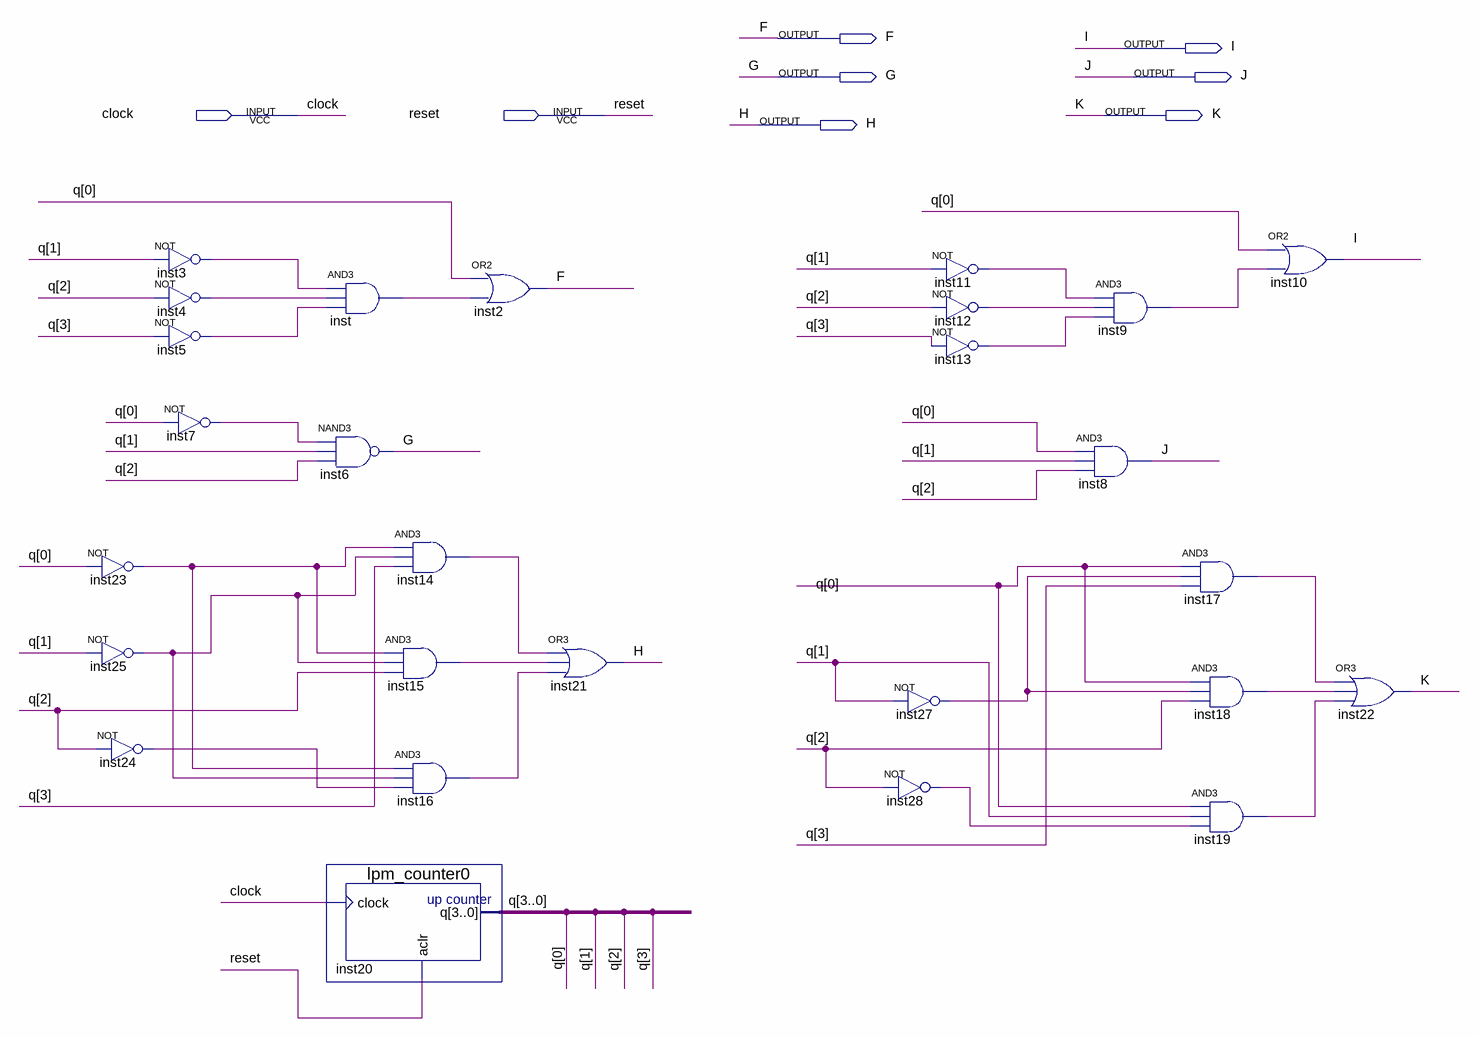
[diagram p0: schematic sheet]
// Quartus schematic traffic.bdf as structural Verilog: 27 symbols, 8 pins
module traffic (
  input  clock,
  input  reset,
  output F,
  output I,
  output G,
  output J,
  output K,
  output H
);

  wire inst3_out, inst4_out, inst5_out, inst7_out, inst9_out, inst11_out, inst12_out, inst13_out, inst14_out,
       inst15_out, inst16_out, inst17_out, inst18_out, inst19_out, inst23_out, inst24_out, inst25_out,
       inst27_out, inst28_out, inst_out;
  wire [3:0] q;

  not inst23 (inst23_out, q[0]);
  not inst25 (inst25_out, q[1]);
  not inst24 (inst24_out, q[2]);
  not inst3 (inst3_out, q[1]);
  not inst4 (inst4_out, q[2]);
  not inst5 (inst5_out, q[3]);
  not inst7 (inst7_out, q[0]);
  and inst (inst_out, inst3_out, inst4_out, inst5_out);
  nand inst6 (G, inst7_out, q[1], q[2]);
  lpm_counter0 inst20 (.clock(clock), .aclr(reset), .q(q));
  and inst14 (inst14_out, inst23_out, inst25_out, q[3]);
  and inst15 (inst15_out, inst23_out, inst25_out, q[2]);
  and inst16 (inst16_out, inst23_out, inst25_out, inst24_out);
  or inst2 (F, q[0], inst_out);
  or inst21 (H, inst14_out, inst15_out, inst16_out);
  not inst27 (inst27_out, q[1]);
  not inst28 (inst28_out, q[2]);
  not inst11 (inst11_out, q[1]);
  not inst12 (inst12_out, q[2]);
  not inst13 (inst13_out, q[3]);
  and inst9 (inst9_out, inst11_out, inst12_out, inst13_out);
  and inst8 (J, q[0], q[1], q[2]);
  and inst17 (inst17_out, q[0], inst27_out, q[3]);
  and inst18 (inst18_out, q[0], inst27_out, q[2]);
  and inst19 (inst19_out, q[0], q[1], inst28_out);
  or inst10 (I, q[0], inst9_out);
  or inst22 (K, inst17_out, inst18_out, inst19_out);
endmodule
